# Altium schematic sheet SoundGen.SchDoc: LiveDesign Evaluation - Countdown
size A4; Organization: Altium Limited; Address1: L3, 12a Rodborough Rd; Address2: Frenchs Forest; Address3: NSW; Address4: Australia 2086; DocumentNumber: 3; SheetNumber: 3; SheetTotal: 4
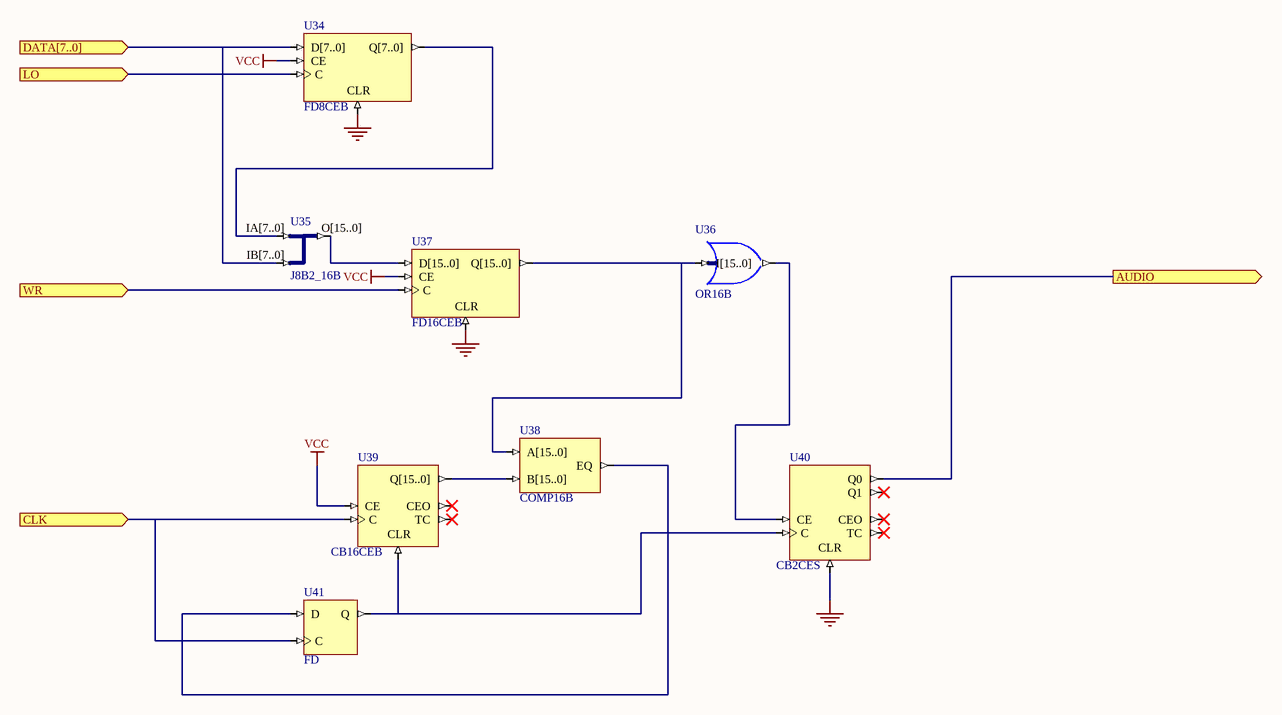
[diagram p0: SoundGen.SchDoc]

## Parts
U34  FD8CEB
U35  J8B2_16B
U36  OR16B
U37  FD16CEB
U38  COMP16B
U39  CB16CEB
U40  CB2CES
U41  FD

## Ports
AUDIO (out), CLK (in), DATA[7..0] (in), LO (in), WR (in)

## Nets
GND: U34.CLR U37.CLR U40.CLR
VCC: U34.CE U37.CE U39.CE
AUDIO: U40.Q0 ; port AUDIO
CLK: U39.C U41.C ; port CLK
DATA[7..0]: U34.D[7..0] U35.IB[7..0] ; port DATA[7..0]
LO: U34.C ; port LO
WR: U37.C ; port WR
NetU34_Q[7..0]: U34.Q[7..0] U35.IA[7..0]
NetU35_O[15..0]: U35.O[15..0] U37.D[15..0]
NetU36_I[15..0]: U36.I[15..0] U37.Q[15..0] U38.A[15..0]
NetU36_O: U36.O U40.CE
NetU38_B[15..0]: U38.B[15..0] U39.Q[15..0]
NetU38_EQ: U38.EQ U41.D
NetU39_CLR: U39.CLR U40.C U41.Q

Not connected (* = marked no-connect by the designer): U39 CEO* TC*; U40 CEO* Q1* TC*

## Notes on the sheet
- Title
- Size:
- Date:
- A4
- Number:
- Time:
- Revision:
- Sheet
- of
- File:

## Library data of the parts
U34 = FD8CEB: 8-Bit D-Type Flip-Flop with Clock Enable and Asynchronous Clear, Bus Version; XilinxEquivalent: FD8CE; SubClass: FD; ClockTrigger: Rising; Enable: High; PortSize: 8; ArchiveName: GENERIC; VHDLIB_SIM: GENERIC_LIB; Published: 29-Jan-2004; Publisher: Altium Limited; LastRevisionNo: 1.00.00; HelpURL: CR0118 FPGA Generic Library Guide.pdf#page=173; FunctionalClass: Flip-Flop; Reset: Asynchronous; PortStyle: Bus Version
U35 = J8B2_16B: 2 x 8-Bit input bus to 1 x 16-bit output bus; FunctionalClass: Bus Joiner; PortSize: 8; ArchiveName: GENERIC; VHDLIB_SIM: GENERIC_LIB; Published: 29-Jan-2004; Publisher: Altium Limited; LastRevisionNo: 1.00.00; HelpURL: CR0118 FPGA Generic Library Guide.pdf#page=301
U36 = OR16B: 16-Input OR Gate, Bus Version; FunctionalClass: Logic Primitive; PortSize: 16; ArchiveName: GENERIC; VHDLIB_SIM: GENERIC_LIB; Published: 29-Jan-2004; Publisher: Altium Limited; LastRevisionNo: 1.00.00; HelpURL: CR0118 FPGA Generic Library Guide.pdf#page=404; SubClass: OR; PortStyle: Bus Version
U37 = FD16CEB: 16-Bit D-Type Flip-Flop with Clock Enable and Asynchronous Clear, Bus Version; SubClass: FD; ClockTrigger: Rising; Enable: High; PortSize: 16; ArchiveName: GENERIC; VHDLIB_SIM: GENERIC_LIB; Published: 29-Jan-2004; Publisher: Altium Limited; LastRevisionNo: 1.00.00; HelpURL: CR0118 FPGA Generic Library Guide.pdf#page=173; FunctionalClass: Flip-Flop; Reset: Asynchronous; PortStyle: Bus Version
U38 = COMP16B: 16-Bit Identity Comparator, Bus Version; ArchiveName: GENERIC; VHDLIB_SIM: GENERIC_LIB; Xilinx Equivalent: COMP16; Published: 29-Jan-2004; Publisher: Altium Limited; Core Revision: 1.00.00
U39 = CB16CEB: 16-Bit Cascadable Binary Counters with Clock Enable and Asynchronous Clear, Bus Version; XilinxEquivalent: CB16CE; ClockTrigger: Rising; Enable: High; PortSize: 16; ArchiveName: GENERIC; VHDLIB_SIM: GENERIC_LIB; Published: 29-Jan-2004; Publisher: Altium Limited; LastRevisionNo: 1.00.00; HelpURL: CR0118 FPGA Generic Library Guide.pdf#page=127; FunctionalClass: Counter; SubClass: Binary; Reset: Asynchronous; PortType: Bus Version
U40 = CB2CES: 2-Bit Cascadable Binary Counters with Clock Enable and Asynchronous Clear, Single Pin Version; XilinxEquivalent: CB2CE; ClockTrigger: Rising; Enable: High; PortSize: 2; ArchiveName: GENERIC; VHDLIB_SIM: GENERIC_LIB; Published: 29-Jan-2004; Publisher: Altium Limited; LastRevisionNo: 1.00.00; HelpURL: CR0118 FPGA Generic Library Guide.pdf#page=127; FunctionalClass: Counter; SubClass: Binary; Reset: Asynchronous; PortType: Single Pin Version
U41 = FD: D-Type Flip-Flop; ClockTrigger: Rising; ArchiveName: GENERIC; VHDLIB_SIM: GENERIC_LIB; Published: 29-Jan-2004; Publisher: Altium Limited; XilinxEquivalent: FD; LastRevisionNo: 1.00.00; HelpURL: CR0118 FPGA Generic Library Guide.pdf#page=169; FunctionalClass: Flip-Flop; SubClass: FD